# Altium project differential probe.PrjPcb
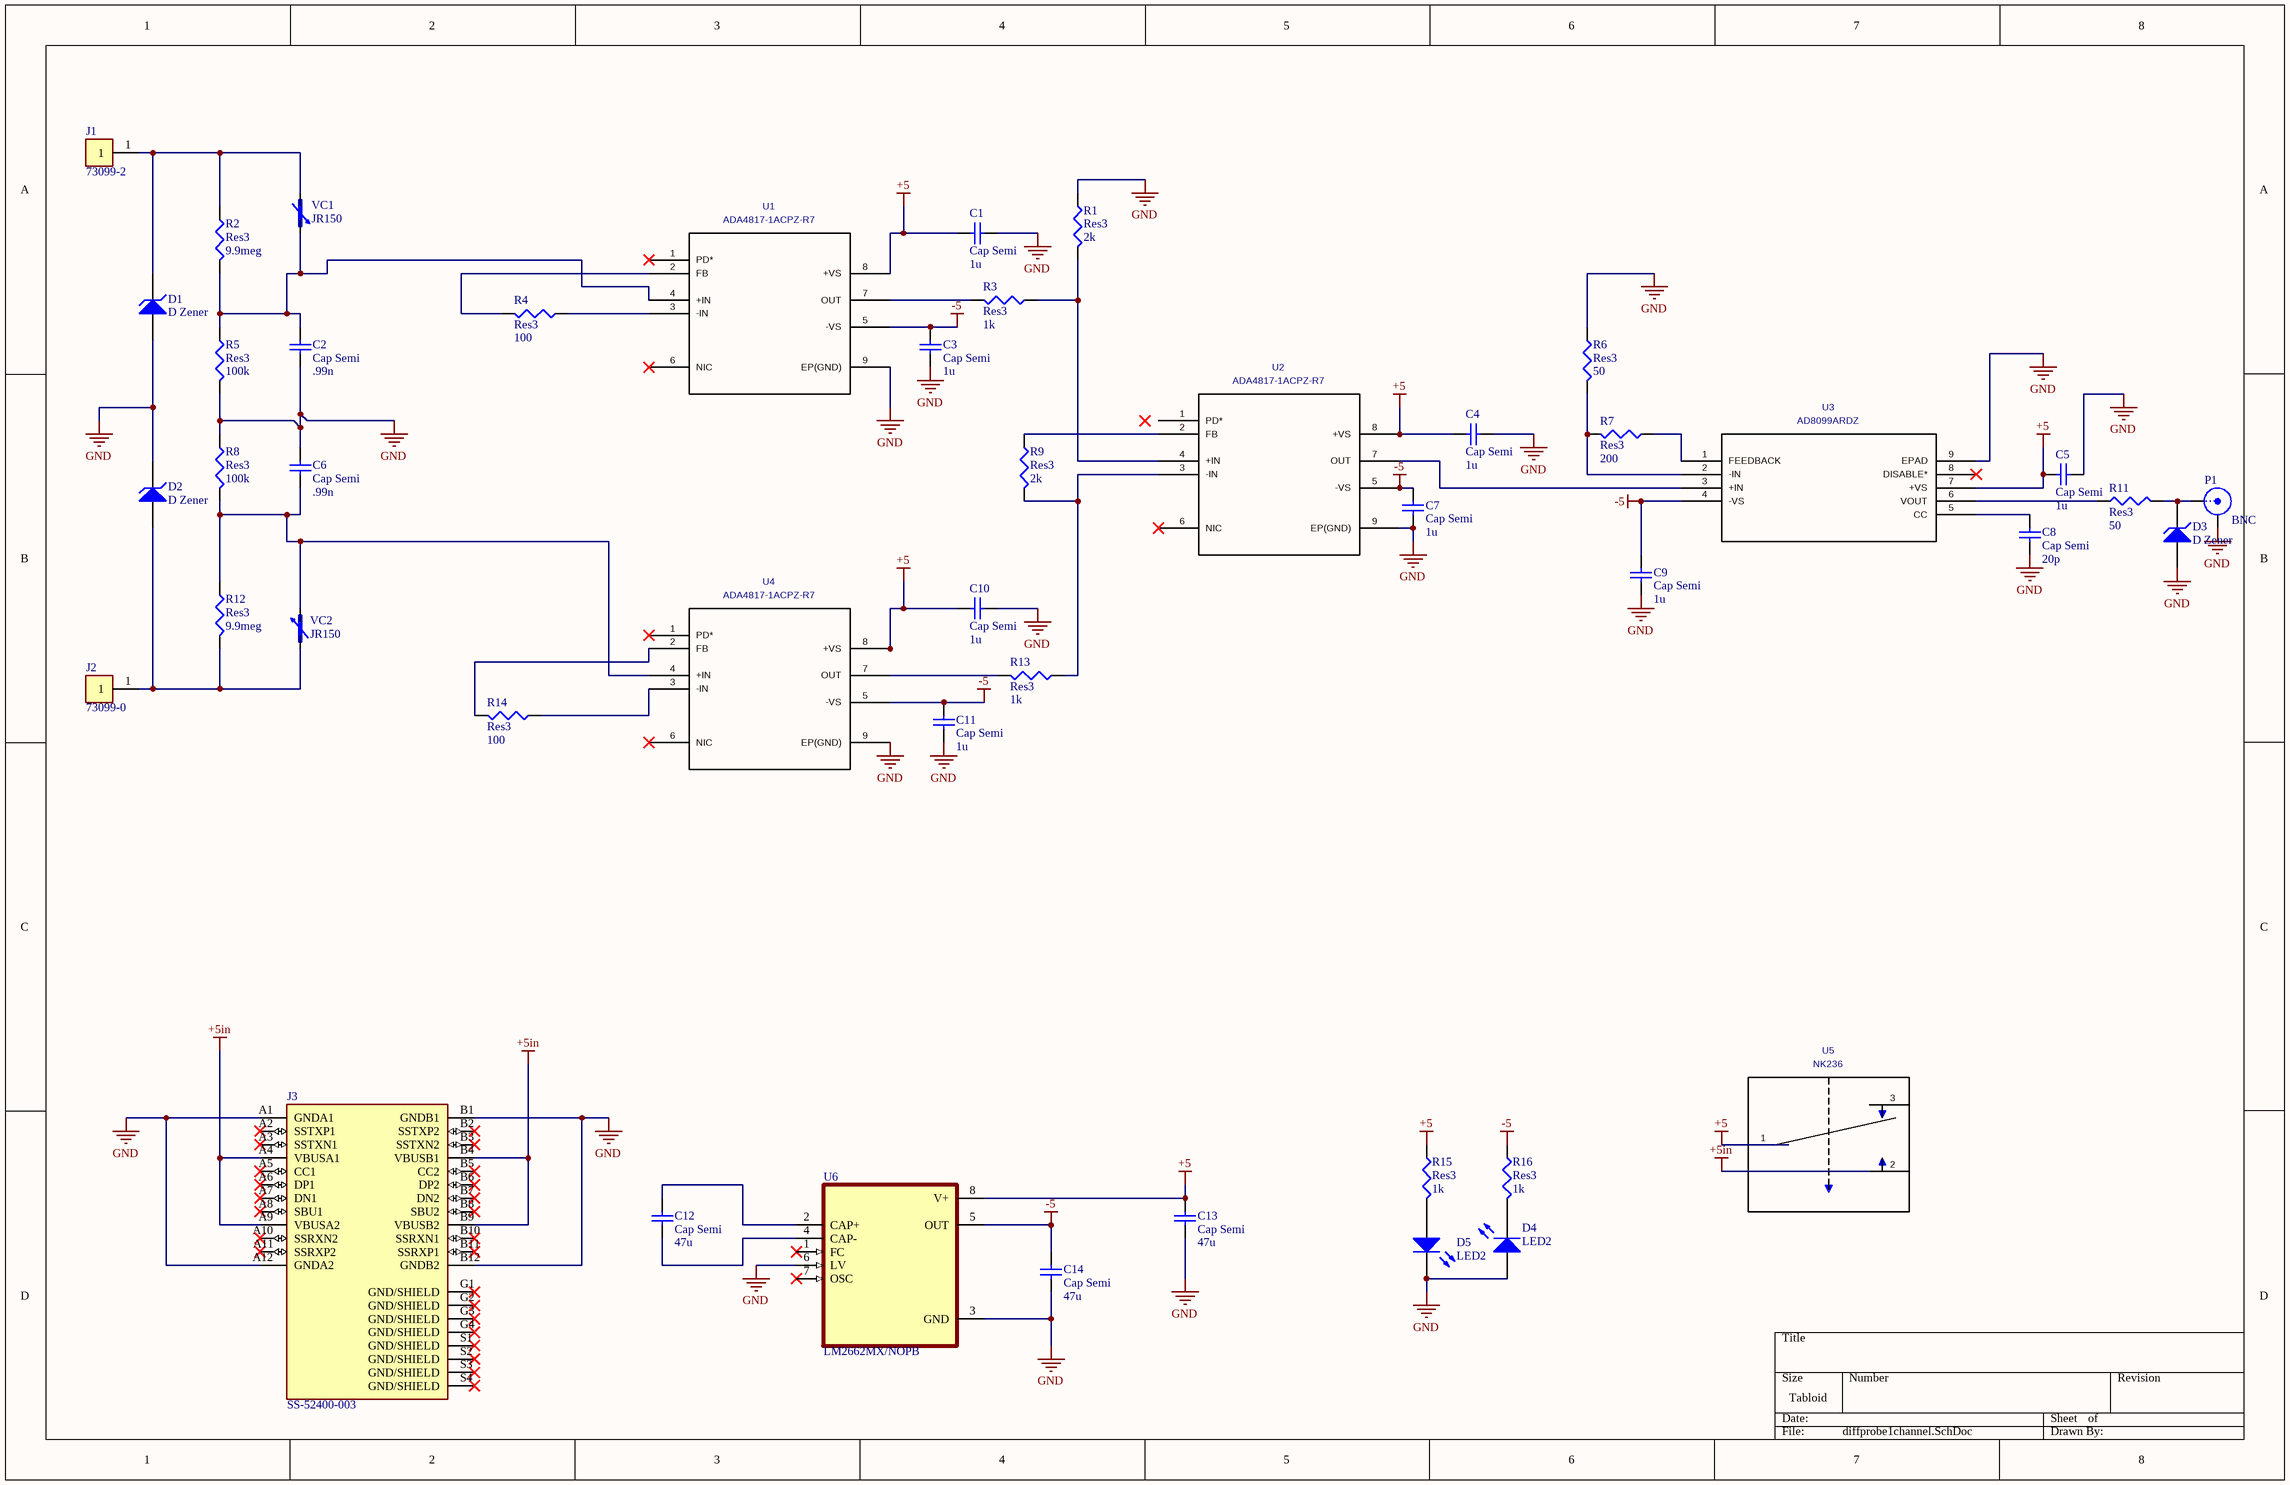
[diagram p0: diffprobe1channel.SchDoc]
1 sheet, 46 parts. Net scope: global (net labels, ports and power ports of the same name join across sheets).

## Sheet diffprobe1channel.SchDoc
size Tabloid

### Parts
C1  Cap Semi  value 1u  [C0805]
C2  Cap Semi  value .99n  [C0805]
C3  Cap Semi  value 1u  [C0805]
C4  Cap Semi  value 1u  [C0805]
C5  Cap Semi  value 1u  [C0805]
C6  Cap Semi  value .99n  [C0805]
C7  Cap Semi  value 1u  [C0805]
C8  Cap Semi  value 20p  [C0805]
C9  Cap Semi  value 1u  [C0805]
C10  Cap Semi  value 1u  [C0805]
C11  Cap Semi  value 1u  [C0805]
C12  Cap Semi  value 47u  [C0805]
C13  Cap Semi  value 47u  [C0805]
C14  Cap Semi  value 47u  [C0805]
D1  D Zener  [SMB]
D2  D Zener  [SMB]
D3  D Zener  [SMB]
D4  LED2  [3.2X1.6X1.1]
D5  LED2  [3.2X1.6X1.1]
J1  73099-2  [POMONA_73099-0]
J2  73099-0  [POMONA_73099-0]
J3  SS-52400-003  [BELFUSE_SS-52400-003]
P1  BNC  [BNC_RA CON]
R1  Res3  value 2k  [J1-0603]
R2  Res3  value 9.9meg  [J1-0603]
R3  Res3  value 1k  [J1-0603]
R4  Res3  value 100  [J1-0603]
R5  Res3  value 100k  [J1-0603]
R6  Res3  value 50  [J1-0603]
R7  Res3  value 200  [J1-0603]
R8  Res3  value 100k  [J1-0603]
R9  Res3  value 2k  [J1-0603]
R11  Res3  value 50  [J1-0603]
R12  Res3  value 9.9meg  [J1-0603]
R13  Res3  value 1k  [J1-0603]
R14  Res3  value 100  [J1-0603]
R15  Res3  value 1k  [J1-0603]
R16  Res3  value 1k  [J1-0603]
U1  ADA4817-1ACPZ-R7  [CP_8_13_ADI]
U2  ADA4817-1ACPZ-R7  [CP_8_13_ADI]
U3  AD8099ARDZ  [RD_8_1_ADI-L]
U4  ADA4817-1ACPZ-R7  [CP_8_13_ADI]
U5  NK236  [SWITCH_NK236_APM_NK236(Primary)]
U6  LM2662MX/NOPB  [SOIC127P599X175-8N]
VC1  JR150  [CAPV_JR150]
VC2  JR150  [CAPV_JR150]

### Nets
+5: C1.1 C4.1 C5.1 C10.1 C13.2 R15.1 U1.8(+VS) U2.8(+VS) U3.7(+VS) U4.8(+VS) U5.1 U6.8(V+)
+5in: J3.A4(VBUSA1) J3.A9(VBUSA2) J3.B4(VBUSB1) J3.B9(VBUSB2) U5.2
-5: C3.2 C7.2 C9.2 C11.2 C14.2 R16.1 U1.5(-VS) U2.5(-VS) U3.4(-VS) U4.5(-VS) U6.5(OUT)
GND: C1.2 C2.1 C3.1 C4.2 C5.2 C6.2 C7.1 C8.2 C9.1 C10.2 C11.1 C13.1 C14.1 D1.1(A) D2.2(K) D3.1(A) D4.1(A) D5.2(K) J3.A1(GNDA1) J3.A12(GNDA2) J3.B1(GNDB1) J3.B12(GNDB2) P1.2(Y) R1.1 R5.2 R6.1 R8.1 U1.9(EP(GND)) U2.9(EP(GND)) U3.9(EPAD) U4.9(EP(GND)) U6.3(GND) U6.6(LV)
NetC2_2: C2.2 R2.2 R5.1 U1.4(+IN) VC1.2(E)
NetC6_1: C6.1 R8.2 R12.1 U4.4(+IN) VC2.2(E)
NetC8_1: C8.1 U3.5(CC)
NetC12_1: C12.1 U6.4(CAP-)
NetC12_2: C12.2 U6.2(CAP+)
NetD1_2: D1.2(K) J1.1 R2.1 VC1.1(A)
NetD2_1: D2.1(A) J2.1 R12.2 VC2.1(A)
NetD3_2: D3.2(K) P1.1(X) R11.2
NetD4_2: D4.2(K) R16.2
NetD5_1: D5.1(A) R15.2
NetR1_2: R1.2 R3.1 U2.4(+IN)
NetR3_2: R3.2 U1.7(OUT)
NetR4_1: R4.1 U1.3(-IN)
NetR4_2: R4.2 U1.2(FB)
NetR6_2: R6.2 R7.2 U3.2(-IN)
NetR7_1: R7.1 U3.1(FEEDBACK)
NetR9_1: R9.1 U2.2(FB)
NetR9_2: R9.2 R13.1 U2.3(-IN)
NetR11_1: R11.1 U3.6(VOUT)
NetR13_2: R13.2 U4.7(OUT)
NetR14_1: R14.1 U4.3(-IN)
NetR14_2: R14.2 U4.2(FB)
NetU2_7: U2.7(OUT) U3.3(+IN)

Not connected (* = marked no-connect by the designer): J3 A2(SSTXP1)* A3(SSTXN1)* A5(CC1)* A6(DP1)* A7(DN1)* A8(SBU1)* A10(SSRXN2)* A11(SSRXP2)* B2(SSTXP2)* B3(SSTXN2)* B5(CC2)* B6(DP2)* B7(DN2)* B8(SBU2)* B10(SSRXN1)* B11(SSRXP1)* G1(GND/SHIELD)* G2(GND/SHIELD)* G3(GND/SHIELD)* G4(GND/SHIELD)* S1(GND/SHIELD)* S2(GND/SHIELD)* S3(GND/SHIELD)* S4(GND/SHIELD)*; U1 1(PD*)* 6(NIC)*; U2 1(PD*) 6(NIC)*; U3 8(DISABLE*)*; U4 1(PD*)* 6(NIC)*; U5 3; U6 1(FC)* 7(OSC)*

### Library data of the parts
C1-C14 = Cap Semi: Capacitor (Semiconductor SIM Model); Published: 8-Jun-2000; LatestRevisionDate: 29-May-2009; LatestRevisionNote: IPC-7351 Footprint Added.; PackageReference: C1206; Publisher: Altium Limited; PackageDescription: Chip Capacitor
D1 D2 = D Zener: Zener Diode; Value: 300; Published: 8-Jun-2000; LatestRevisionDate: 17-Jul-2002; LatestRevisionNote: Re-released for DXP Platform.; PackageReference: DIODE-0.7; Publisher: Altium Limited; PackageDescription: Diode, Thru-Hole; 2 Leads; 0.7 in Pin Spacing
D3 = D Zener: Zener Diode; Value: 5; Published: 8-Jun-2000; LatestRevisionDate: 17-Jul-2002; LatestRevisionNote: Re-released for DXP Platform.; PackageReference: DIODE-0.7; Publisher: Altium Limited; PackageDescription: Diode, Thru-Hole; 2 Leads; 0.7 in Pin Spacing
D4 D5 = LED2: Typical RED, GREEN, YELLOW, AMBER GaAs LED; Published: 8-Jun-2000; LatestRevisionDate: 17-Jul-2002; LatestRevisionNote: Re-released for DXP Platform.; PackageVersion: Feb-2002; PackageReference: 3.2X1.6X1.1; Publisher: Altium Limited; PackageDescription: SM LED; 2 Flat Leads
J1 J2 = 73099-0: Banana Jack Connector Standard Banana Solder Black; MF: Pomona Electronics; Value: *; MP: 73099-0; Package: None; SnapEDA_Link: https://www.snapeda.com/parts/73099-0/Pomona%20Electronics/view-part/4593268/?ref=snap; Digi-Key_Part_Number: 501-73099-0-ND; Digi-Key_Purchase_URL: https://www.digikey.com/product-detail/en/pomona-electronics/73099-0/501-73099-0-ND/10483460?utm_source=snapeda&utm_medium=aggregator&utm_campaign=symbol
J3 = SS-52400-003: USB Type-C Connector | 1 Port | Right Angle Receptacle | Shielded | 0.063[1.60mm]; MF: Stewart Connector; Mouser-Purchase-URL: https://snapeda.com/shop?store=Mouser&id=4629167; Package: None; Price: None; Value: *; MP: SS-52400-003; DigiKey-Purchase-URL: https://snapeda.com/shop?store=DigiKey&id=4629167; SnapEDA_Link: https://www.snapeda.com/parts/SS-52400-003/Stewart%20Connector/view-part/4629167/?ref=snap; Availability: Unavailable
P1 = BNC: BNC Elbow Connector; LatestRevisionDate: 17-Jul-2002; LatestRevisionNote: Re-released for DXP Platform.; Publisher: Altium Limited
R1-R9 R11-R16 = Res3: Resistor; Published: 8-Jun-2000; LatestRevisionDate: 29-May-2009; LatestRevisionNote: IPC-7351 Footprint Added.; PackageReference: J1-0603; Publisher: Altium Limited; PackageDescription: Chip Resistor
U1 U2 U4 = ADA4817-1ACPZ-R7: Mfr_Name: Analog Devices Inc; Value: ADA4817-1ACPZ-R7; Copyright: Copyright (C) 2021 Ultra Librarian. All rights reserved.; Manufacturer_Part_Number: ADA4817-1ACPZ-R7; Digi-Key_Part_Number_1: ADA4817-1ACPZ-R7CT-ND; Digi-Key_Part_Number_2: ADA4817-1ACPZ-R7DKR-ND; Digi-Key_Part_Number_3: ADA4817-1ACPZ-R7TR-ND
U3 = AD8099ARDZ: Mfr_Name: Analog Devices Inc; Value: AD8099ARDZ; Copyright: Copyright (C) 2021 Ultra Librarian. All rights reserved.; Manufacturer_Part_Number: AD8099ARDZ; Digi-Key_Part_Number_1: AD8099ARDZ-ND; Digi-Key_Part_Number_2: 2156-AD8099ARDZ-ND
U5 = NK236: Mfr_Name: Apem; C: Copyright (C) 2015 Accelerated Designs. All rights reserved; Value: NK236; Copyright: Copyright (C) 2021 Ultra Librarian. All rights reserved.; Manufacturer_Part_Number: NK236; Digi-Key_Part_Number_1: 679-1860-ND
U6 = LM2662MX/NOPB: 200mA switched capacitor voltage converter 8-SOIC -40 to 85; MF: Texas Instruments; Digi-Key_Part_Number: LM2662MX/NOPBCT-ND; Texas_Instruments-Purchase-URL: https://snapeda.com/shop?store=Texas+Instruments&id=1039801; SnapEDA_Link: https://www.snapeda.com/parts/LM2662MX/NOPB/Texas%20Instruments/view-part/1039801/?ref=snap; Value: *; MP: LM2662MX/NOPB; Package: SOIC-8 Texas Instruments
VC1 VC2 = JR150: 3 ~ 15pF Trimmer Capacitor 125V Top Surface Mount; MF: Knowles Voltronics; MP: JR150; SnapEDA_Link: https://www.snapeda.com/parts/JR150/Knowles%20Voltronics/view-part/324291/?ref=snap; Price: None; DigiKey-Purchase-URL: https://snapeda.com/shop?store=DigiKey&id=324291; Package: Knowles Voltronics; Mouser-Purchase-URL: https://snapeda.com/shop?store=Mouser&id=324291; Value: *; Availability: Warning